# Altium schematic sheet UNI_sensor.SchDoc
size A4
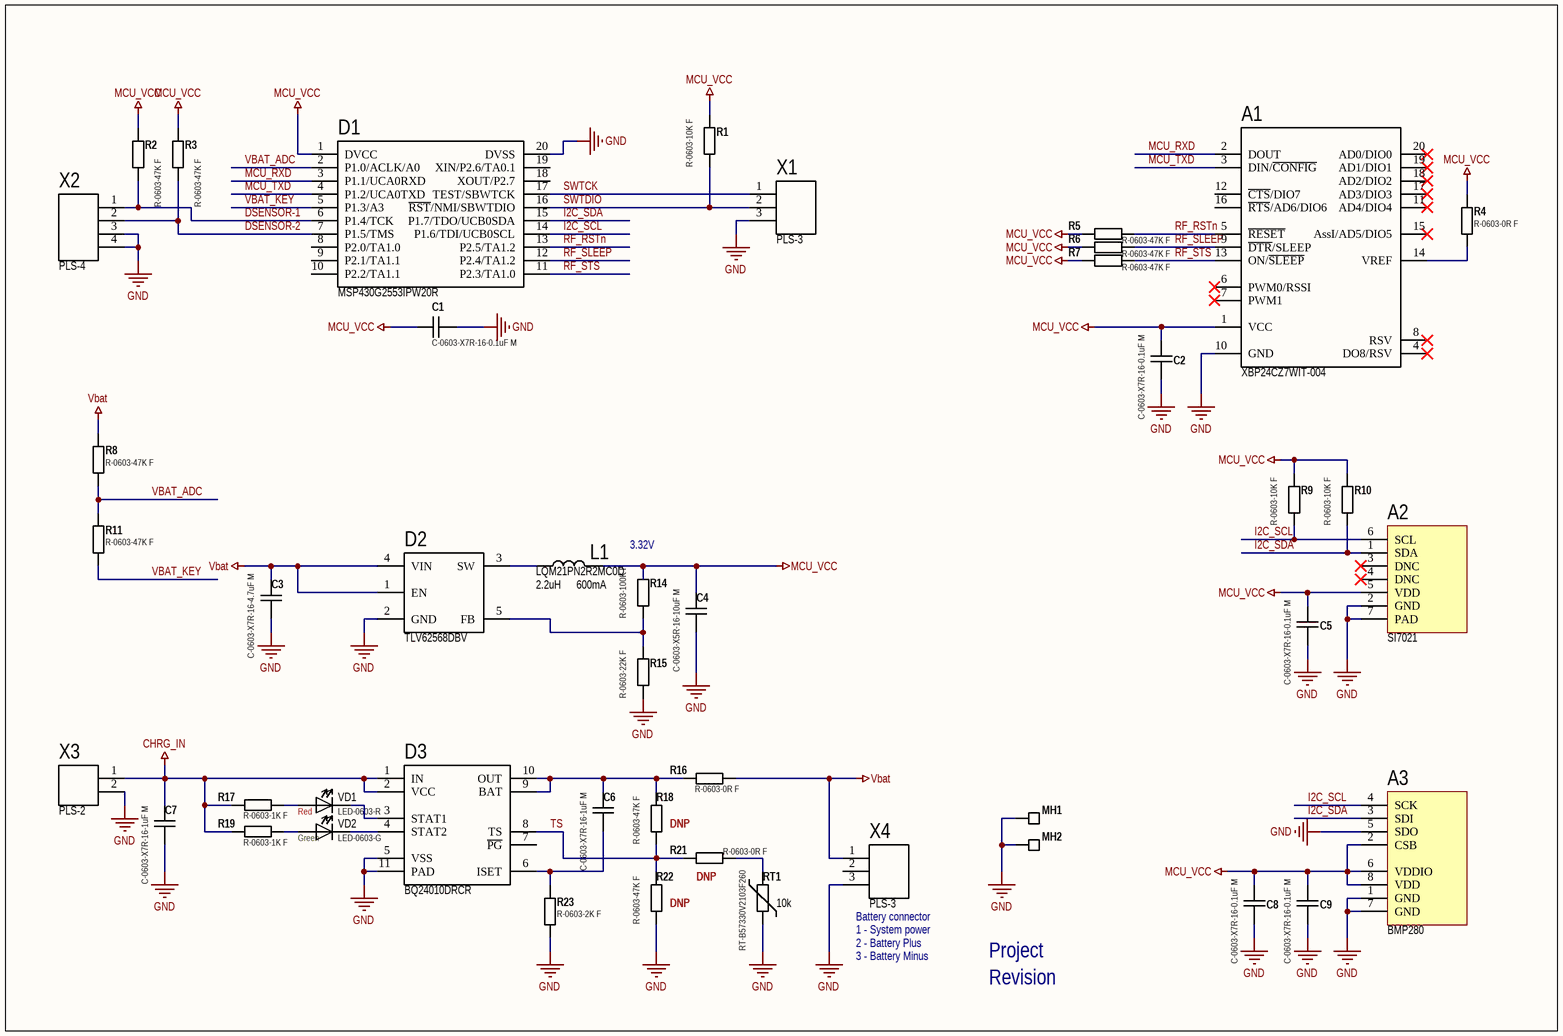
[diagram p0: UNI_sensor.SchDoc]

## Parts
A1  XBP24CZ7WIT-004  [XBEE]
A2  SI7021  [SI7021]
A3  BMP280  [BMP280]
C1  C-0603-X7R-16-0.1uF M  [CAPC160X80X100L35N]
C2  C-0603-X7R-16-0.1uF M  [CAPC160X80X100L35N]
C3  C-0603-X7R-16-4.7uF M  [CAPC160X80X100L35N]
C4  C-0603-X5R-16-10uF M  [CAPC160X80X100L35N]
C5  C-0603-X7R-16-0.1uF M  [CAPC160X80X100L35N]
C6  C-0603-X7R-16-1uF M  [CAPC160X80X100L35N]
C7  C-0603-X7R-16-1uF M  [CAPC160X80X100L35N]
C8  C-0603-X7R-16-0.1uF M  [CAPC160X80X100L35N]
C9  C-0603-X7R-16-0.1uF M  [CAPC160X80X100L35N]
D1  MSP430G2553IPW20R  [TSSOP-20]
D2  TLV62568DBV  [SOT23-5]
D3  BQ24010DRCR  [QFN-11 (3x3)]
L1  LQM21PN2R2MC0D  value 2.2uH  MaxCurrent: 600mA  [L0805_BLM21]
MH1  Testpoint  [MHole_3.5_6mm]  (value not drawn)  (no BOM)
MH2  Testpoint  [MHole_3.5_6mm]  (value not drawn)  (no BOM)
R1  R-0603-10K F  [RESC160X80X55L30N]
R2  R-0603-47K F  [RESC160X80X55L30N]
R3  R-0603-47K F  [RESC160X80X55L30N]
R4  R-0603-0R F  [RESC160X80X55L30N]
R5  R-0603-47K F  [RESC160X80X55L30N]
R6  R-0603-47K F  [RESC160X80X55L30N]
R7  R-0603-47K F  [RESC160X80X55L30N]
R8  R-0603-47K F  [RESC160X80X55L30N]
R9  R-0603-10K F  [RESC160X80X55L30N]
R10  R-0603-10K F  [RESC160X80X55L30N]
R11  R-0603-47K F  [RESC160X80X55L30N]
R14  R-0603-100K F  [RESC160X80X55L30N]
R15  R-0603-22K F  [RESC160X80X55L30N]
R16  R-0603-0R F  [RESC160X80X55L30N]
R17  R-0603-1K F  [RESC160X80X55L30N]
R18  R-0603-47K F  DoNotPlace: DNP  [RESC160X80X55L30N]
R19  R-0603-1K F  [RESC160X80X55L30N]
R21  R-0603-0R F  DoNotPlace: DNP  [RESC160X80X55L30N]
R22  R-0603-47K F  DoNotPlace: DNP  [RESC160X80X55L30N]
R23  R-0603-2K F  [RESC160X80X55L30N]
RT1  RT-B57330V2103F260  value 10k  [RESC160X80X55L30N]
VD1  LED-0603-R  Color: Red  [LEDC1608X60N]
VD2  LED-0603-G  Color: Green  [LEDC1608X60N]
X1  PLS-3  [PLS3]
X2  PLS-4  [PLS4]
X3  PLS-2  [PLS2]
X4  PLS-3  [PLS3]

## Nets
CHRG_IN: C7.1 D3.1(IN) D3.2(VCC) R17.1 R19.1 X3.1
GND: A1.10(GND) A2.2(GND) A2.7(PAD) A3.1(GND) A3.5(SDO) A3.7(GND) C1.2 C2.2 C3.2 C4.2 C5.2 C7.2 C8.2 C9.2 D1.20(DVSS) D2.2(GND) D3.5(VSS) D3.11(PAD) MH1.1 MH2.1 R15.1 R22.1 R23.1 RT1.2 X1.3 X2.3 X2.4 X3.2 X4.3
MCU_VCC: A1.1(VCC) A2.5(VDD) A3.2(CSB) A3.6(VDDIO) A3.8(VDD) C1.1 C2.1 C4.1 C5.1 C8.1 C9.1 D1.1(DVCC) L1.2 R1.2 R2.2 R3.2 R4.1 R5.2 R6.2 R7.2 R9.2 R10.2 R14.2
Vbat: C3.1 D2.1(EN) D2.4(VIN) R8.2 R16.1 X4.1
DSENSOR-1: D1.6(P1.4/TCK) R2.1 X2.1
DSENSOR-2: D1.7(P1.5/TMS) R3.1 X2.2
I2C_SCL: A2.6(SCL) A3.4(SCK) D1.14(P1.6/TDI/UCB0SCL) R9.1
I2C_SDA: A2.1(SDA) A3.3(SDI) D1.15(P1.7/TDO/UCB0SDA) R10.1
MCU_RXD: A1.2(DOUT) D1.3(P1.1/UCA0RXD)
MCU_TXD: A1.3(DIN/~{CONFIG}) D1.4(P1.2/UCA0TXD)
RF_RSTn: A1.5(~{RESET}) D1.13(P2.5/TA1.2) R5.1
RF_SLEEP: A1.9(~{DTR}/SLEEP) D1.12(P2.4/TA1.2) R6.1
RF_STS: A1.13(ON/~{SLEEP}) D1.11(P2.3/TA1.0) R7.1
SWTCK: D1.17(TEST/SBWTCK) X1.1
SWTDIO: D1.16(~{RST}/NMI/SBWTDIO) R1.1 X1.2
TS: D3.8(TS) R18.1 R21.2 R22.2
VBAT_ADC: D1.2(P1.0/ACLK/A0) R8.1 R11.2
VBAT_KEY: D1.5(P1.3/A3) R11.1
NetA1_14: A1.14(VREF) R4.2
NetC6_1: C6.1 D3.9(BAT) D3.10(OUT) R16.2 R18.2
NetC6_2: C6.2 D3.6(ISET) R23.2
NetD2_3: D2.3(SW) L1.1
NetD2_5: D2.5(FB) R14.1 R15.2
NetD3_3: D3.3(STAT1) VD1.2(K)
NetD3_4: D3.4(STAT2) VD2.2(K)
NetR17_2: R17.2 VD1.1(A)
NetR19_2: R19.2 VD2.1(A)
NetR21_1: R21.1 RT1.1

Not connected (* = marked no-connect by the designer): A1 4(DO8/RSV)* 6(PWM0/RSSI)* 7(PWM1)* 8(RSV)* 11(AD4/DIO4)* 12(~{CTS}/DIO7) 15(AssI/AD5/DIO5)* 16(~{RTS}/AD6/DIO6) 17(AD3/DIO3)* 18(AD2/DIO2)* 19(AD1/DIO1)* 20(AD0/DIO0)*; A2 3(DNC)* 4(DNC)*; D1 8(P2.0/TA1.0) 9(P2.1/TA1.1) 10(P2.2/TA1.1) 18(XOUT/P2.7) 19(XIN/P2.6/TA0.1); D3 7(~{PG}); X4 2

## Notes on the sheet
- (near R14) 3.32V
- (near X4) Battery connector
- (near X4) 1 - System power
- (near X4) 2 - Battery Plus
- 3 - Battery Minus
- Project
- Revision

## Library data of the parts
A1 = XBP24CZ7WIT: XBee Module; Manufacturer: Digi; Component_Type: Микромодуль; Mount_Type: Manual; UID: A-XBP24CZ7WIT-004; Partnumber: XBP24CZ7WIT-004
A2 = SI7021: I2C HUMIDITY AND TEMPERATURE SENSOR; Manufacturer: Silicon Labs; Component_Type: Датчик; Mount_Type: Auto; Partnumber: SI7021; UID: A-SI7021
A3 = BMP280: Digital Pressure Sensor; Manufacturer: Bosch Sensortec; Component_Type: Датчик; Mount_Type: Auto; Partnumber: BMP280; UID: A-BMP280
C1 C2 C5 C8 C9 = C: General capacitor; Manufacturer: Murata; Component_Type: Конденсатор; Mount_Type: Auto; Tolerance: 20%; Voltage: 16V; Value: 0.1uF; TC: X7R; Partnumber: *; PnP_Name: C-0603-X7R-16-0.1uF M; Size: 0603; UID: C-0603-X7R-16-0.1uF M
C3 = C: General capacitor; Manufacturer: Murata; Component_Type: Конденсатор; Mount_Type: Auto; Tolerance: 20%; Voltage: 16V; Value: 4.7uF; TC: X7R; PnP_Name: C-0603-16-4.7uF M; Partnumber: *; Size: 0603; UID: C-0603-X7R-16-4.7uF M
C4 = C: General capacitor; Manufacturer: Murata; Component_Type: Конденсатор; Mount_Type: Auto; Tolerance: 20%; Voltage: 16V; Value: 10uF; TC: X5R; Partnumber: *; PnP_Name: C-0603-X5R-16-10uF M; Size: 0603; UID: C-0603-X5R-16-10uF M
C6 C7 = C: General capacitor; Manufacturer: Murata; Component_Type: Конденсатор; Mount_Type: Auto; Tolerance: 20%; Voltage: 16V; Value: 1uF; TC: X7R; Partnumber: *; PnP_Name: C-0603-X7R-16-1uF M; Size: 0603; UID: C-0603-X7R-16-1uF M
D1 = MSP430G2553IPW20R: 16-bit microcontroller; Manufacturer: Texas Instruments; Component_Type: Микросхема; Mount_Type: Auto; PnP_Name: D-MSP430G2553IPW20R; Partnumber: MSP430G2553IPW20R; UID: D-MSP430G2553IPW20R
D2 = TLV62568DBV: 1-A High Efficiency Synchronous Buck Converterin SOT Package; Manufacturer: Texas Instruments; Component_Type: Микросхема; Mount_Type: Auto; Partnumber: TLV62568DBV; UID: D-TLV62568DBV
D3 = BQ24010: Single-Chip, Li-Ion Charge Management IC for Handheld Applications (bqTINY™); Manufacturer: Texas Instruments; Component_Type: Микросхема; Mount_Type: Auto; PnP_Name: D-BQ24010DRCR; Partnumber: BQ24010DRCR; UID: D-BQ24010DRCR
L1 = L: General inductor; Manufacturer: Murata; Mount_Type: Auto; Component_Type: Катушка индуктивности; Tolerance: 20%; Partnumber: LQM21PN2R2MC0D; Size: 0805; PnP_Name: *; UID: L-LQM21PN2R2MC0D
MH1 MH2 = Test_point: Test point
R1 R9 R10 = R: General resistor; Manufacturer: Yageo; Mount_Type: Auto; Component_Type: Резистор; Tolerance: 1%; Value: 10k; Partnumber: *; Size: 0603; PnP_Name: R-0603-10K F; UID: R-0603-10K F; TC: -
R2 R3 R5-R8 R11 R18 R22 = R: General resistor; Manufacturer: Yageo; Mount_Type: Auto; Component_Type: Резистор; Tolerance: 1%; Value: 47k; Partnumber: *; Size: 0603; PnP_Name: R-0603-47K F; UID: R-0603-47K F; TC: -
R4 R16 R21 = R: General resistor; Manufacturer: Yageo; Mount_Type: Auto; Component_Type: Резистор; Value: 0; Partnumber: *; Tolerance: -; Size: 0603; PnP_Name: R-0603-0R F; UID: R-0603-0R F; TC: -
R14 = R: General resistor; Manufacturer: Yageo; Mount_Type: Auto; Component_Type: Резистор; Tolerance: 1%; Value: 100k; Partnumber: *; Size: 0603; PnP_Name: R-0603-100K F; UID: R-0603-100K F; TC: -
R15 = R: General resistor; Manufacturer: Yageo; Mount_Type: Auto; Component_Type: Резистор; Tolerance: 1%; Value: 22k; Partnumber: *; Size: 0603; PnP_Name: R-0603-22K F; UID: R-0603-22K F; TC: -
R17 R19 = R: General resistor; Manufacturer: Yageo; Mount_Type: Auto; Component_Type: Резистор; Tolerance: 1%; Value: 1k; Partnumber: *; Size: 0603; PnP_Name: R-0603-1K F; UID: R-0603-1K F; TC: -
R23 = R: General resistor; Manufacturer: Yageo; Mount_Type: Auto; Component_Type: Резистор; Tolerance: 1%; Value: 2k; Partnumber: *; Size: 0603; PnP_Name: R-0603-2K F; UID: R-0603-2K F; TC: -
RT1 = R_T: Thermistor; Manufacturer: Epcos; Mount_Type: Auto; Component_Type: Терморезистор; Tolerance: 1%; TC: NTC; Partnumber: B57330V2103F260; Size: 0603; PnP_Name: RT-B57330V2103F260; UID: RT-B57330V2103F260
VD1 VD2 = LED: pin to pad: 1>2 2>1; Component_Type: Индикатор; PnP_Name: *; Manufacturer: *; Partnumber: *; Size: 0603
  VD1: UID: LED-0603-R
  VD2: UID: LED-0603-G
X1 X4 = Conn_3: Manufacturer: KLS; Component_Type: Разъём; Mount_Type: Manual; Partnumber: PLS-3; UID: X-PLS-3
X2 = Conn_4: Component_Type: Разъём; Mount_Type: Manual; Manufacturer: -; Partnumber: PLS-4; UID: X-PLS-4
X3 = Conn_2: Manufacturer: KLS; Component_Type: Разъём; Mount_Type: Manual; Partnumber: PLS-2; UID: X-PLS-2